# EAGLE schematic MiniBee (EAGLE 5.07)
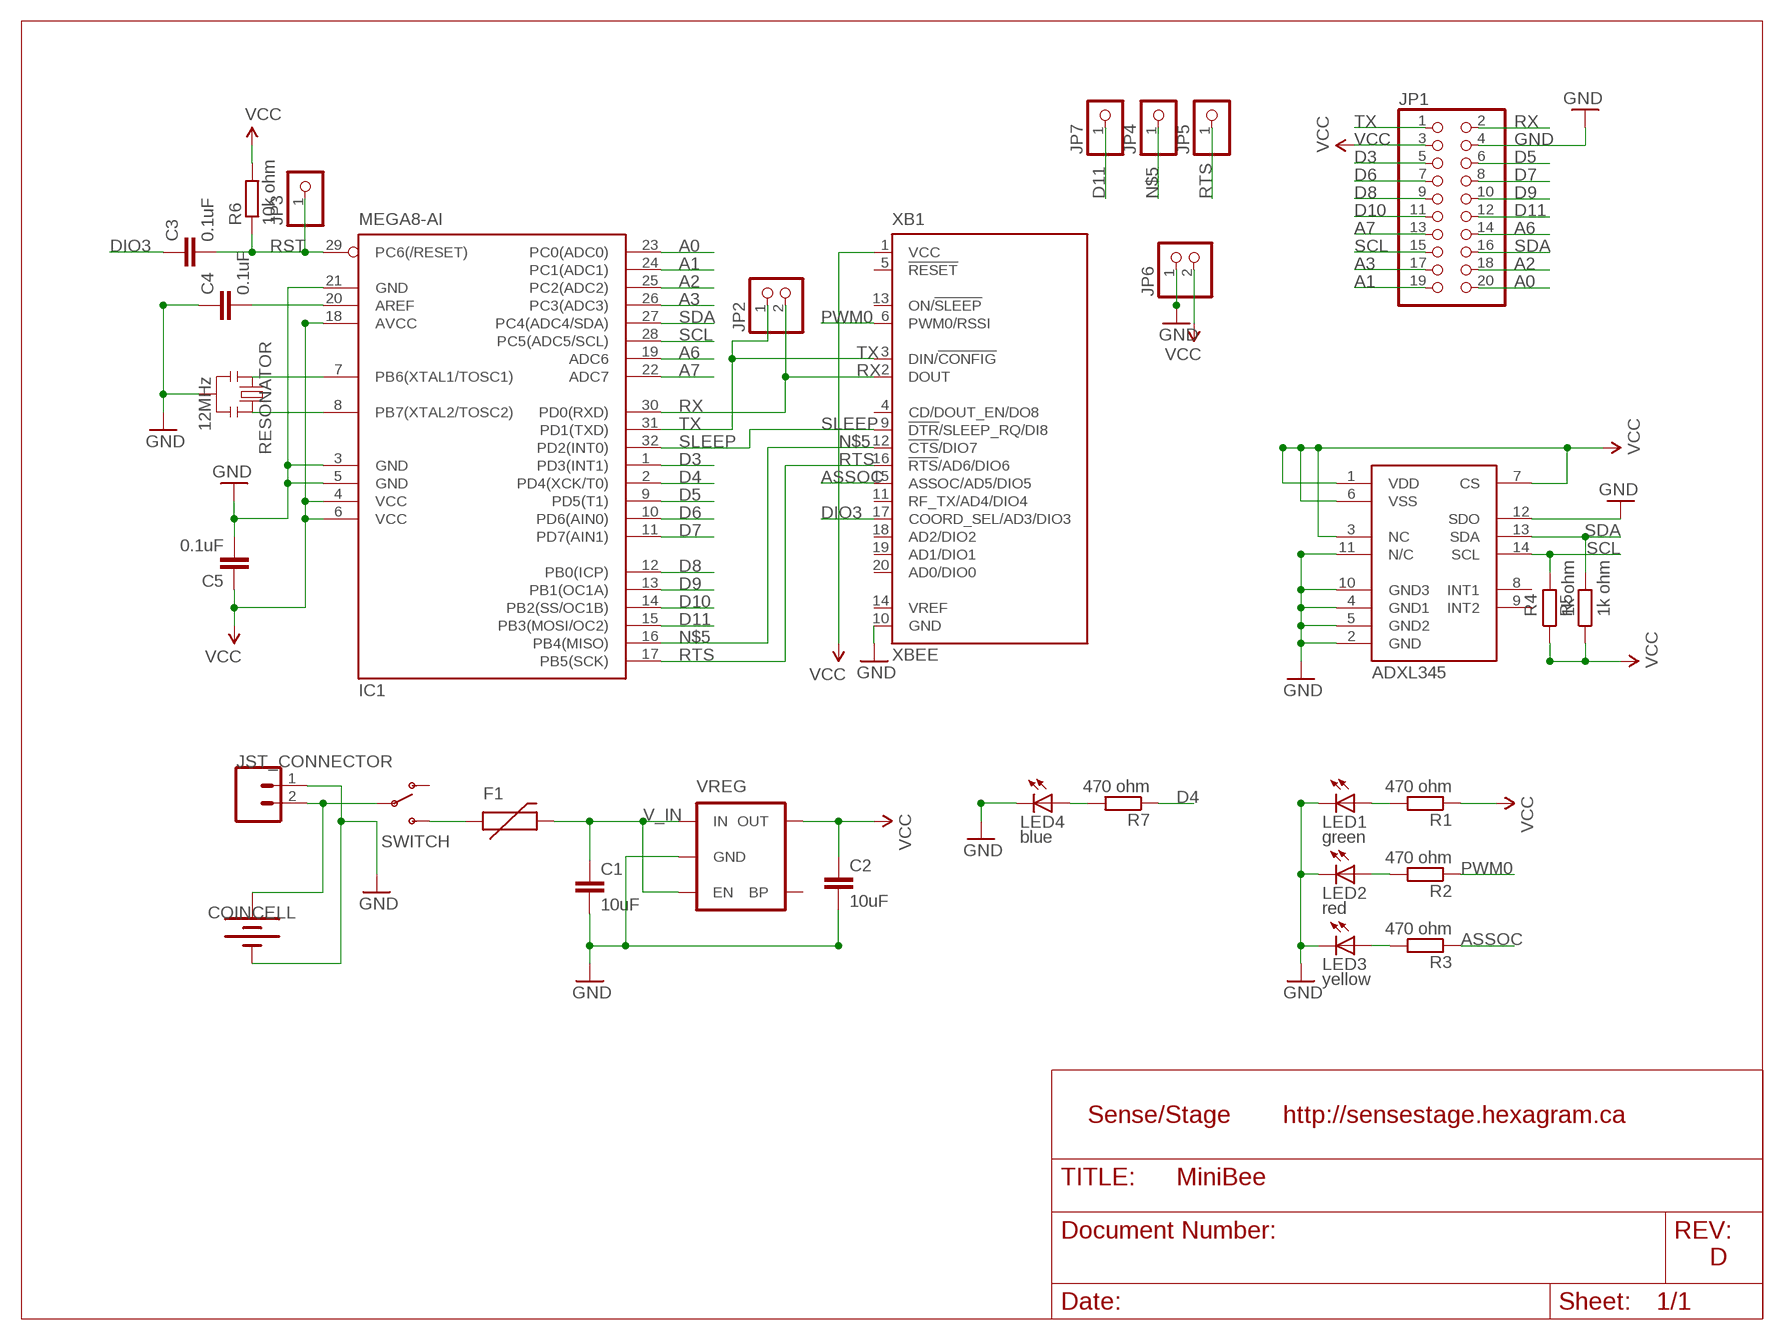
[diagram p0: schematic, sheet 1]

## Parts
C1  10uF  C-EUC0805  [C0805]
C2  10uF  C-EUC0805  [C0805]
C3  0.1uF  C-EUC0402  [C0402]
C4  0.1uF  C-EUC0402  [C0402]
C5  0.1uF  C-EUC0402  [C0402]
COINCELL  COINCELL  KEYSTONE_BATTERY_HOLDER  [KEYSTONE_BATTERY_HOLDER]
F1  PTCSMD  [PTC-1206]
IC1  MEGA8-AI  [TQFP32-08]
JP1  PINHD-2X10  [2X10]
JP2  PINHD-1X2  [1X02]
JP3  PINHD-1X1  [1X01]
JP4  PINHD-1X1  [1X01]
JP5  PINHD-1X1  [1X01]
JP6  PINHD-1X2  [1X02]
JP7  PINHD-1X1  [1X01]
JST_CONNECTOR  JST_CONNECTOR  M02-JST-2MM-SMT  [S2B-PH]
LED1  green  LEDCHIP-LED0603  [CHIP-LED0603]
LED2  red  LEDCHIP-LED0603  [CHIP-LED0603]
LED3  yellow  LEDCHIP-LED0603  [CHIP-LED0603]
LED4  blue  LEDCHIP-LED0603  [CHIP-LED0603]
R1  470 ohm  R-EU_R0402  [R0402]
R2  470 ohm  R-EU_R0402  [R0402]
R3  470 ohm  R-EU_R0402  [R0402]
R4  1k ohm  R-EU_R0402  [R0402]
R5  1k ohm  R-EU_R0402  [R0402]
R6  10k ohm  R-EU_R0402  [R0402]
R7  470 ohm  R-EU_R0402  [R0402]
RESONATOR  12MHz  RESONATORSMD  [RESONATOR-SMD]
SWITCH  SWITCH  PCM_SWITCH  [PCM_SWITCH_RA]
U1  ADXL345  [LGA14]
VREG  V_REG_LDOSMD  [SOT23-5]
XB1  XBEE  [XBEE]

## Nets
A0: IC1.23(PC0(ADC0)) JP1.20
A1: IC1.24(PC1(ADC1)) JP1.19
A2: IC1.25(PC2(ADC2)) JP1.18
A3: IC1.26(PC3(ADC3)) JP1.17
A6: IC1.19(ADC6) JP1.14
A7: IC1.22(ADC7) JP1.13
ASSOC: R3.1 XB1.15(ASSOC/AD5/DIO5)
D3: IC1.1(PD3(INT1)) JP1.5
D4: IC1.2(PD4(XCK/T0)) R7.1
D5: IC1.9(PD5(T1)) JP1.6
D6: IC1.10(PD6(AIN0)) JP1.7
D7: IC1.11(PD7(AIN1)) JP1.8
D8: IC1.12(PB0(ICP)) JP1.9
D9: IC1.13(PB1(OC1A)) JP1.10
D10: IC1.14(PB2(SS/OC1B)) JP1.11
D11: IC1.15(PB3(MOSI/OC2)) JP1.12 JP7.1
DIO3: C3.1 XB1.17(COORD_SEL/AD3/DIO3)
GND: C1.2 C2.2 C4.1 C5.2 COINCELL.- IC1.3(GND) IC1.5(GND) IC1.21(GND) JP1.4 JP6.1 JST_CONNECTOR.1 LED1.C LED2.C LED3.C LED4.C RESONATOR.2 U1.2(GND) U1.4(GND1) U1.5(GND2) U1.10(GND3) U1.11(N/C) U1.12(SDO) VREG.2(GND) XB1.10(GND)
N$1: IC1.7(PB6(XTAL1/TOSC1)) RESONATOR.1
N$2: IC1.8(PB7(XTAL2/TOSC2)) RESONATOR.3
N$3: LED1.A R1.2
N$4: COINCELL.+ JST_CONNECTOR.2 SWITCH.2(P)
N$5: IC1.16(PB4(MISO)) JP4.1 XB1.12(!CTS!/DIO7)
N$6: LED2.A R2.2
N$7: LED3.A R3.2
N$8: F1.1 SWITCH.3(S)
N$9: C4.2 IC1.20(AREF)
N$10: LED4.A R7.2
PWM0: R2.1 XB1.6(PWM0/RSSI)
RST: C3.2 IC1.29(PC6(/RESET)) JP3.1 R6.1
RTS: IC1.17(PB5(SCK)) JP5.1 XB1.16(!RTS!/AD6/DIO6)
RX: IC1.30(PD0(RXD)) JP1.2 JP2.2 XB1.2(DOUT)
SCL: IC1.28(PC5(ADC5/SCL)) JP1.15 R4.2 U1.14(SCL)
SDA: IC1.27(PC4(ADC4/SDA)) JP1.16 R5.2 U1.13(SDA)
SLEEP: IC1.32(PD2(INT0)) XB1.9(!DTR!/SLEEP_RQ/DI8)
TX: IC1.31(PD1(TXD)) JP1.1 JP2.1 XB1.3(DIN/!CONFIG)
V_IN: C1.1 F1.2 VREG.1(IN) VREG.3(EN)
VCC: C2.1 C5.1 IC1.4(VCC) IC1.6(VCC) IC1.18(AVCC) JP1.3 JP6.2 R1.1 R4.1 R5.1 R6.2 U1.1(VDD) U1.3(NC) U1.6(VSS) U1.7(CS) VREG.5(OUT) XB1.1(VCC)
Unconnected: SWITCH.1(O) U1.8(INT1) U1.9(INT2) VREG.4(BP) XB1.4(CD/DOUT_EN/DO8) XB1.5(!RESET) XB1.11(RF_TX/AD4/DIO4) XB1.13(ON/!SLEEP) XB1.14(VREF) XB1.18(AD2/DIO2) XB1.19(AD1/DIO1) XB1.20(AD0/DIO0)

## Notes on the sheet
- Sense/Stage | http://sensestage.hexagram.ca
- D

## Library data of the parts
C1-C5 = rcl:C-EU: CAPACITOR, European symbol
COINCELL = myShit:KEYSTONE_BATTERY_HOLDER
F1 = SparkFun:PTC: Resettable Fuse PTC Resettable Fuse. Spark Fun Electronics SKU : COM-08357
IC1 = atmel:MEGA8: MICROCONTROLLER 8 Kbytes FLASH, 1 kbytes SRAM, 512 bytes EEPROM, USART, 6-channel 10 bit ADC, 2-channel 8 bit ADC Pin compatible with Atmega48, ATMega88, ATMega168 Source: avr.lbr
JP1 = myShit:PINHD-2X10: PIN HEADER
JP2 JP6 = myShit:PINHD-1X2: PIN HEADER
JP3-JP5 JP7 = myShit:PINHD-1X1: PIN HEADER
JST_CONNECTOR = SparkFun:M02: Header 2 Standard 2-pin 0.1" header. Use with straight break away headers (SKU : PRT-00116), right angle break away headers (PRT-00553), swiss pins (PRT-00743), machine pins (PRT-00117), and female headers (PRT-00115). Molex polarized connector foot print use with SKU : PRT-08233 with associated crimp pins and housings.
LED1-LED4 = led:LED: LED OSRAM: - CHIPLED LG R971, LG N971, LY N971, LG Q971, LY Q971, LO R971, LY R971 LH N974, LH R974 LS Q976, LO Q976, LY Q976 LO Q996 - Hyper CHIPLED LW Q18S LB Q993, LB Q99A, LB R99A - SideLED LS A670, LO A670, LY A670, LG A670, LP A670 LB A673, LV A673, LT A673, LW A673 LH A674 LY A675 LS A676, LA A676, LO A676, LY A676, LW A676 LS A679, LY A679, LG A679 - Hyper Micro SIDELED® LS Y876, LA Y876, LO Y876, LY Y876 LT Y87S - SmartLED LW L88C, LW L88S LB L89C, LB L89S, LG L890 LS L89K, LO L89K, LY L89K LS L896, LA L896, LO L896, LY L896 - TOPLED LS T670, LO T670, LY T670, LG T670, LP T670 LSG T670, LSP T670, LSY T670, LOP T670, LYG T670 LG T671, LOG T671, LSG T671 LB T673, LV T673, LT T673, LW T673 LH T674 LS T676, LA T676, LO T676, LY T676, LB T676, LH T676, LSB T676, LW T676 LB T67C, LV T67C, LT T67C, LS T67K, LO T67K, LY T67K, LW E67C LS E67B, LA E67B, LO E67B, LY E67B, LB E67C, LV E67C, LT E67C LW T67C LS T679, LY T679, LG T679 LS T770, LO T770, LY T770, LG T770, LP T770 LB T773, LV T773, LT T773, LW T773 LH T774 LS E675, LA E675, LY E675, LS T675 LS T776, LA T776, LO T776, LY T776, LB T776 LHGB T686 LT T68C, LB T68C - Hyper Mini TOPLED® LB M676 - Mini TOPLED Santana® LG M470 LS M47K, LO M47K, LY M47K Source: http://www.osram.convergy.de LUXEON: - LUMILED® LXK2-PW12-R00, LXK2-PW12-S00, LXK2-PW14-U00, LXK2-PW14-V00 LXK2-PM12-R00, LXK2-PM12-S00, LXK2-PM14-U00 LXK2-PE12-Q00, LXK2-PE12-R00, LXK2-PE12-S00, LXK2-PE14-T00, LXK2-PE14-U00 LXK2-PB12-K00, LXK2-PB12-L00, LXK2-PB12-M00, LXK2-PB14-N00, LXK2-PB14-P00, LXK2-PB14-Q00 LXK2-PR12-L00, LXK2-PR12-M00, LXK2-PR14-Q00, LXK2-PR14-R00 LXK2-PD12-Q00, LXK2-PD12-R00, LXK2-PD12-S00 LXK2-PH12-R00, LXK2-PH12-S00 LXK2-PL12-P00, LXK2-PL12-Q00, LXK2-PL12-R00 Source: www.luxeon.com KINGBRIGHT: KA-3528ASYC Source: www.kingbright.com
R1-R7 = rcl:R-EU_: RESISTOR, European symbol
RESONATOR = SparkFun:RESONATOR: Resonator Small SMD resonator. This is the itty bitty 10/20MHz resonators with built in caps. CSTCE10M0G55 and CSTCE20M0V53. Footprint has been reviewed closely but hasn't been tested yet.
SWITCH = myShit:PCM_SWITCH
U1 = SparkFun:ADXL345
VREG = SparkFun:V_REG_LDO: Voltage Regulator LDO Standard 150mA LDO voltage regulator in SOT-23 layout. Micrel part MIC5205. BP (by-pass) pin is used to lower output noise with 470pF cap.
XB1 = maxstream:XBEE: XBee (TM) /XBee-PRO(TM) OEM RF Modules Source: MaxStream, Inc. xbee_productmanual.pdf